# Altium schematic sheet power.SchDoc
size A4
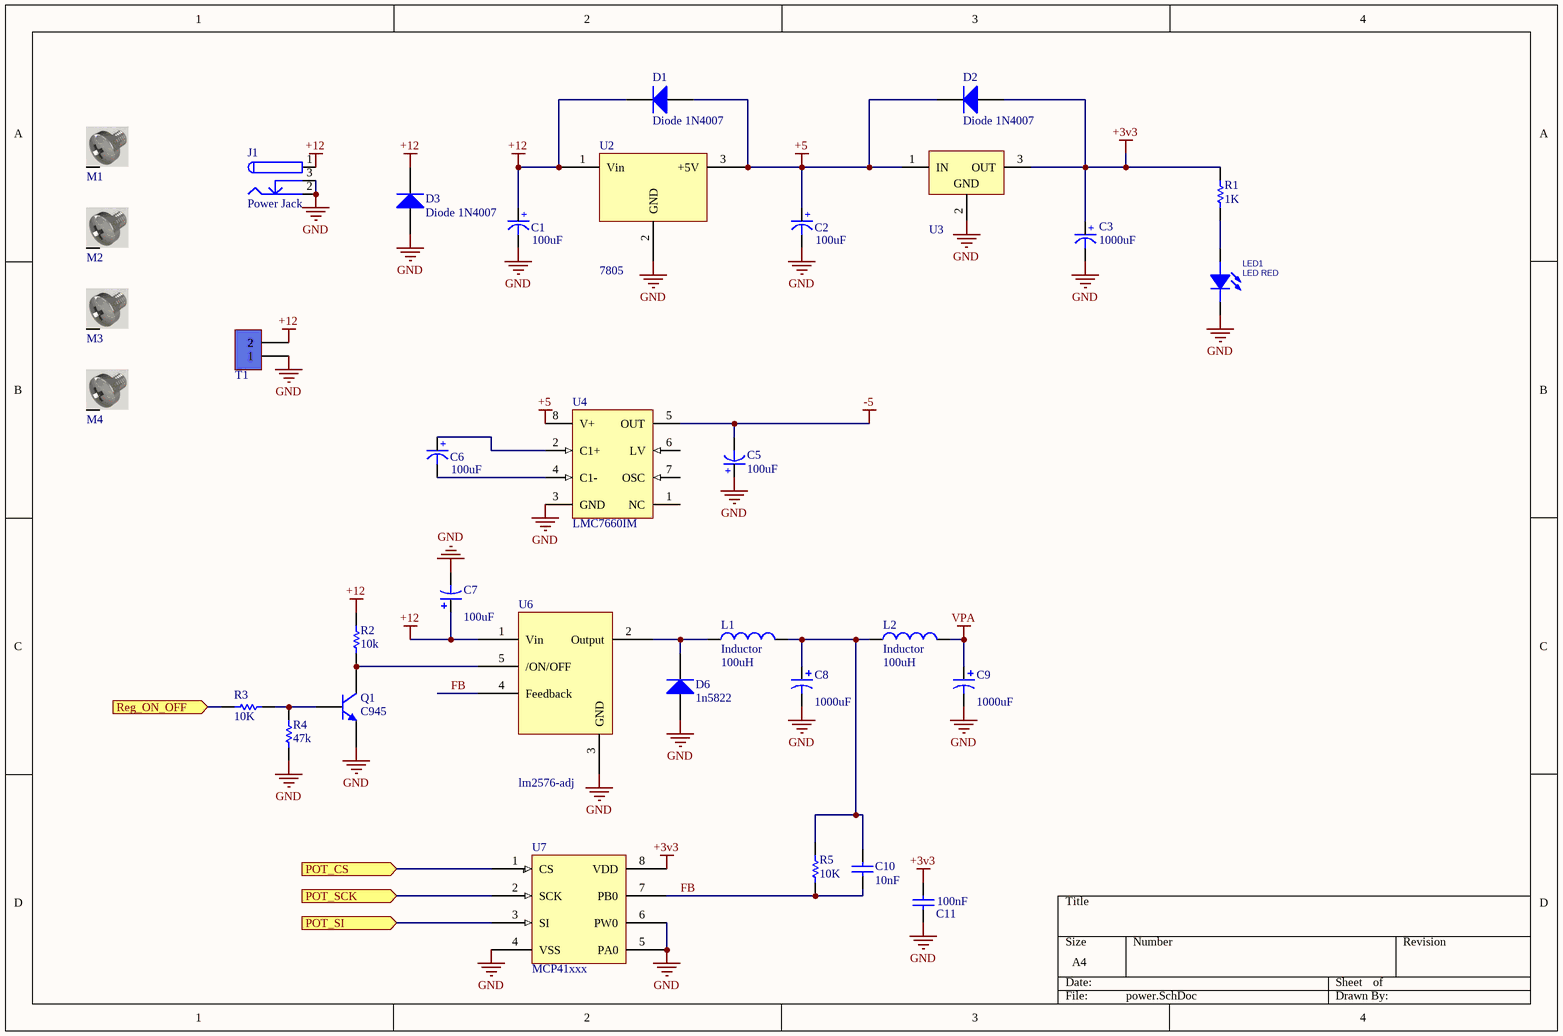
[diagram p0: power.SchDoc]

## Parts
C1  100uF  [Cap - 3.5mm - 2]
C2  100uF  [Cap - 3.5mm - 2]
C3  1000uF  [Cap - 3.5mm - 2]
C5  100uF  [Cap - 3.5mm - 2]
C6  100uF  [Cap - 3.5mm - 2]
C7  value 100uF  [Cap SMD electrolite-6.3mm]
C8  value 1000uF  [Cap SMD electrolite-10.3mm]
C9  value 1000uF  [Cap SMD electrolite-10.3mm]
C10  value 10nF  [SMD_CAP_0805]  (hidden comment: Cap)
C11  value 100nF  [SMD_CAP_0805]  (hidden comment: Cap)
D1  Diode 1N4007  [SMA DIODE 2]
D2  Diode 1N4007  [SMA DIODE 2]
D3  Diode 1N4007  [SMA DIODE 2]
D6  1n5822  [DO214AC SMA]
J1  Power Jack  [Power Jack]
L1  Inductor  value 100uH  [inductor]
L2  Inductor  value 100uH  [inductor]
LED1  LED RED  [led_0805]
M1  Screw  [Screw]  (value not drawn)
M2  Screw  [Screw]  (value not drawn)
M3  Screw  [Screw]  (value not drawn)
M4  Screw  [Screw]  (value not drawn)
Q1  C945  [SOT23_N]
R1  1K  [RES 0805 (2012X06L)]
R2  value 10k  [RES 0805 (2012X06L)]  (hidden comment: Res1)
R3  value 10K  [RES 0805 (2012X06L)]  (hidden comment: Res1)
R4  value 47k  [RES 0805 (2012X06L)]  (hidden comment: Res1)
R5  10K  [RES 0805 (2012X06L)]
T1  Terminal  [Terminal 1*2_1]  (value not drawn)
U2  7805  [REG-7805-WALL]
U3  Voltage Regulator  [REG-7805-WALL]  (value not drawn)
U4  LMC7660IM  [M08A_N]
U6  lm2576-adj  [2596]
U7  MCP41xxx  [SO8_M]

## Ports
POT_CS (in), POT_SCK (in), POT_SI (in), Reg_ON_OFF (in)

## Nets
+3v3: C3.1(+) C11.2 D2.1(A) R1.2 U3.3(OUT) U7.8(VDD)
+5: C2.1(+) D1.1(A) D2.2(K) U2.3(+5V) U3.1(IN) U4.8(V+)
+12: C1.1(+) C7.1 D1.2(K) D3.2(K) J1.1 R2.2 T1.2 U2.1(Vin) U6.1(Vin)
-5: C5.2(-) U4.5(OUT)
GND: C1.2(-) C2.2(-) C3.2(-) C5.1(+) C7.2 C8.2 C9.2 C11.1 D3.1(A) D6.1(A) J1.2 J1.3 LED1.2(CATHODE) Q1.2(E) R4.1 T1.1 U2.2(GND) U3.2(GND) U4.3(GND) U6.3(GND) U7.4(VSS) U7.5(PA0) U7.6(PW0)
VPA: C9.1 L2.2
FB: C10.2 R5.1 U6.4(Feedback) U7.7(PB0)
POT_CS: U7.1(CS) ; port POT_CS
POT_SCK: U7.2(SCK) ; port POT_SCK
POT_SI: U7.3(SI) ; port POT_SI
Reg_ON_OFF: R3.1 ; port Reg_ON_OFF
NetC6_1: C6.1(+) U4.2(C1+)
NetC6_2: C6.2(-) U4.4(C1-)
NetC8_1: C8.1 C10.1 L1.2 L2.1 R5.2
NetD6_2: D6.2(K) L1.1 U6.2(Output)
NetLED1_1: LED1.1(ANODE) R1.1
NetQ1_1: Q1.1(B) R3.2 R4.2
NetQ1_3: Q1.3(C) R2.1 U6.5(/ON/OFF)

Not connected (* = marked no-connect by the designer): M1 S; M2 S; M3 S; M4 S; U4 1(NC) 6(LV) 7(OSC)

## Library data of the parts
C1-C3 C5 C6 = Cap-Polar: Polar Capacitor; Designer: Saeid Jorablo; Organazation: ControTec; Voltage: 16V; Adding Date: 1387/12/20
  C1 C2 C5 C6: Value: 100uF
  C3: Value: 1000uF
C7-C9 = Cap Pol1: Polarized Capacitor (Radial); Published: 8-Jun-2000; LatestRevisionDate: 17-Jul-2002; LatestRevisionNote: Re-released for DXP Platform.; PackageReference: RB7.6-15; Publisher: Altium Limited; PackageDescription: Polarized Capacitor (Radial); 2 Leads
C10 C11 = Cap ceramic: CAP-100Nf
D1-D3 D6 = Diode 1N4007: 1 Amp General Purpose Rectifier; Published: 8-Jun-2000; LatestRevisionDate: 17-Jul-2002; LatestRevisionNote: Re-released for DXP Platform.; DatasheetVersion: 1998; PackageVersion: Aug-1999; PackageReference: DO-41; Publisher: Altium Limited; PackageDescription: Diode, Axial; Body 5.2 x 2.7 mm (LxDia. max), Lead Dia. 0.86 mm (max); Code_JEDEC: DO-204-AL; ComponentLink1Description: Manufacturer Link; ComponentLink1URL: http://www.fairchildsemi.com/; ComponentLink2Description: Datasheet; ComponentLink2URL: http://www.fairchildsemi.com/ds/1N%2F1N4001.pdf
J1 = Power Jack: Designer: Saeid Jorablo; Company: Personal; Project Name: Laser; Adding Date: 10/21/2009
L1 L2 = Inductor: Code_IEC: 1005; Published: 8-Jun-2000; LatestRevisionDate: 29-May-2009; LatestRevisionNote: IPC-7351 Footprint Added.; PackageReference: 0402-A; Publisher: Altium Limited; PackageDescription: Chip Inductor; Code_JEITA: 0402
LED1 = LED 5MM: Light Emitting Diode; Designer: Abbas Basereh; Data: 16-12-2016; Link: *; Part.No: *
M1-M4 = Board Screw: Board Screw With Spacer
Q1 = C945: NPN Silicon Epitaxial Planar Transistor; Published: 2017-2-8; LatestRevisionDate: 2017; LatestRevisionNote: IPC-7351 Footprint Added.; DatasheetVersion: 2017; PackageVersion: 2017-2-8; PackageReference: SOT23; Publisher: Abbas Basereh; PackageDescription: 3-Pin SOT-23 Package 0.95 mm Pitch, 2.3 mm Lead Span; ComponentLink1Description: Manufacturer Link; ComponentLink1URL: http://www.taitroncomponents.com/; ComponentLink2Description: Datasheet; ComponentLink2URL: http://www.taitroncomponents.com/
R1 R5 = RES Axial 0.25W: Designer: Abbas Basereh; Desc.: RES Axial 0.25W; Data: 4-1-2017
R2-R4 = Res1: Resistor; Published: 8-Jun-2000; LatestRevisionDate: 17-Jul-2002; LatestRevisionNote: Re-released for DXP Platform.; PackageReference: AXIAL-0.3; Publisher: Altium Limited; PackageDescription: Axial Device, Thru-Hole; 2 Leads; 0.3 in Pin Spacing
T1 = Terminal 1*2: Terminal 2 Pin 250VAC 16A; Designer: Seyed Mohsen Ghasemain; E-mail: picpars@gmail.com; ComponentLinkURL: www.picpars.com
U2 = 7805: Regulator
U3 = LF33: Voltage Regulator 3.3 Volt
U4 = LMC7660IM: Switched Capacitor Voltage Converter; Manufacturer: National Semiconductor; CompType: Switch Caps; PackageTopMarking: NSZXTT*LMC76*60IM; PowerWise: N; Published: 4-Dec-2008; DatasheetVersion: Feb-2005; PackageVersion: revL, Sep-2006; PackageReference: M08A; Publisher: Altium Limited; PackageDescription: SOIC Narrow, 4.9 x 3.9 x 1.45mm, 8 Lead, 1.27mm Pitch; PartNumber: LMC7660IM; RoHS: O; PinCount: 8; DigiKeyPartNumber: LMC7660IM-ND; Code_JEDEC: MS-012-AA; Code_IPC: SOIC127P600-8; ComponentLink1Description: LMC7660 Datasheet; ComponentLink1URL: http://www.national.com/ds/LM/LMC7660.pdf; ComponentLink2Description: LMC7660 Web Page; ComponentLink2URL: http://www.national.com/pf/LM/LMC7660.html; ComponentLink3Description: M08A Package Page; ComponentLink3URL: http://www.national.com/packaging/folders/m08a.html
U6 = lm2596